# EAGLE design divisor-de-tension (EAGLE 9.6.2)

## Sheet 1 of 2
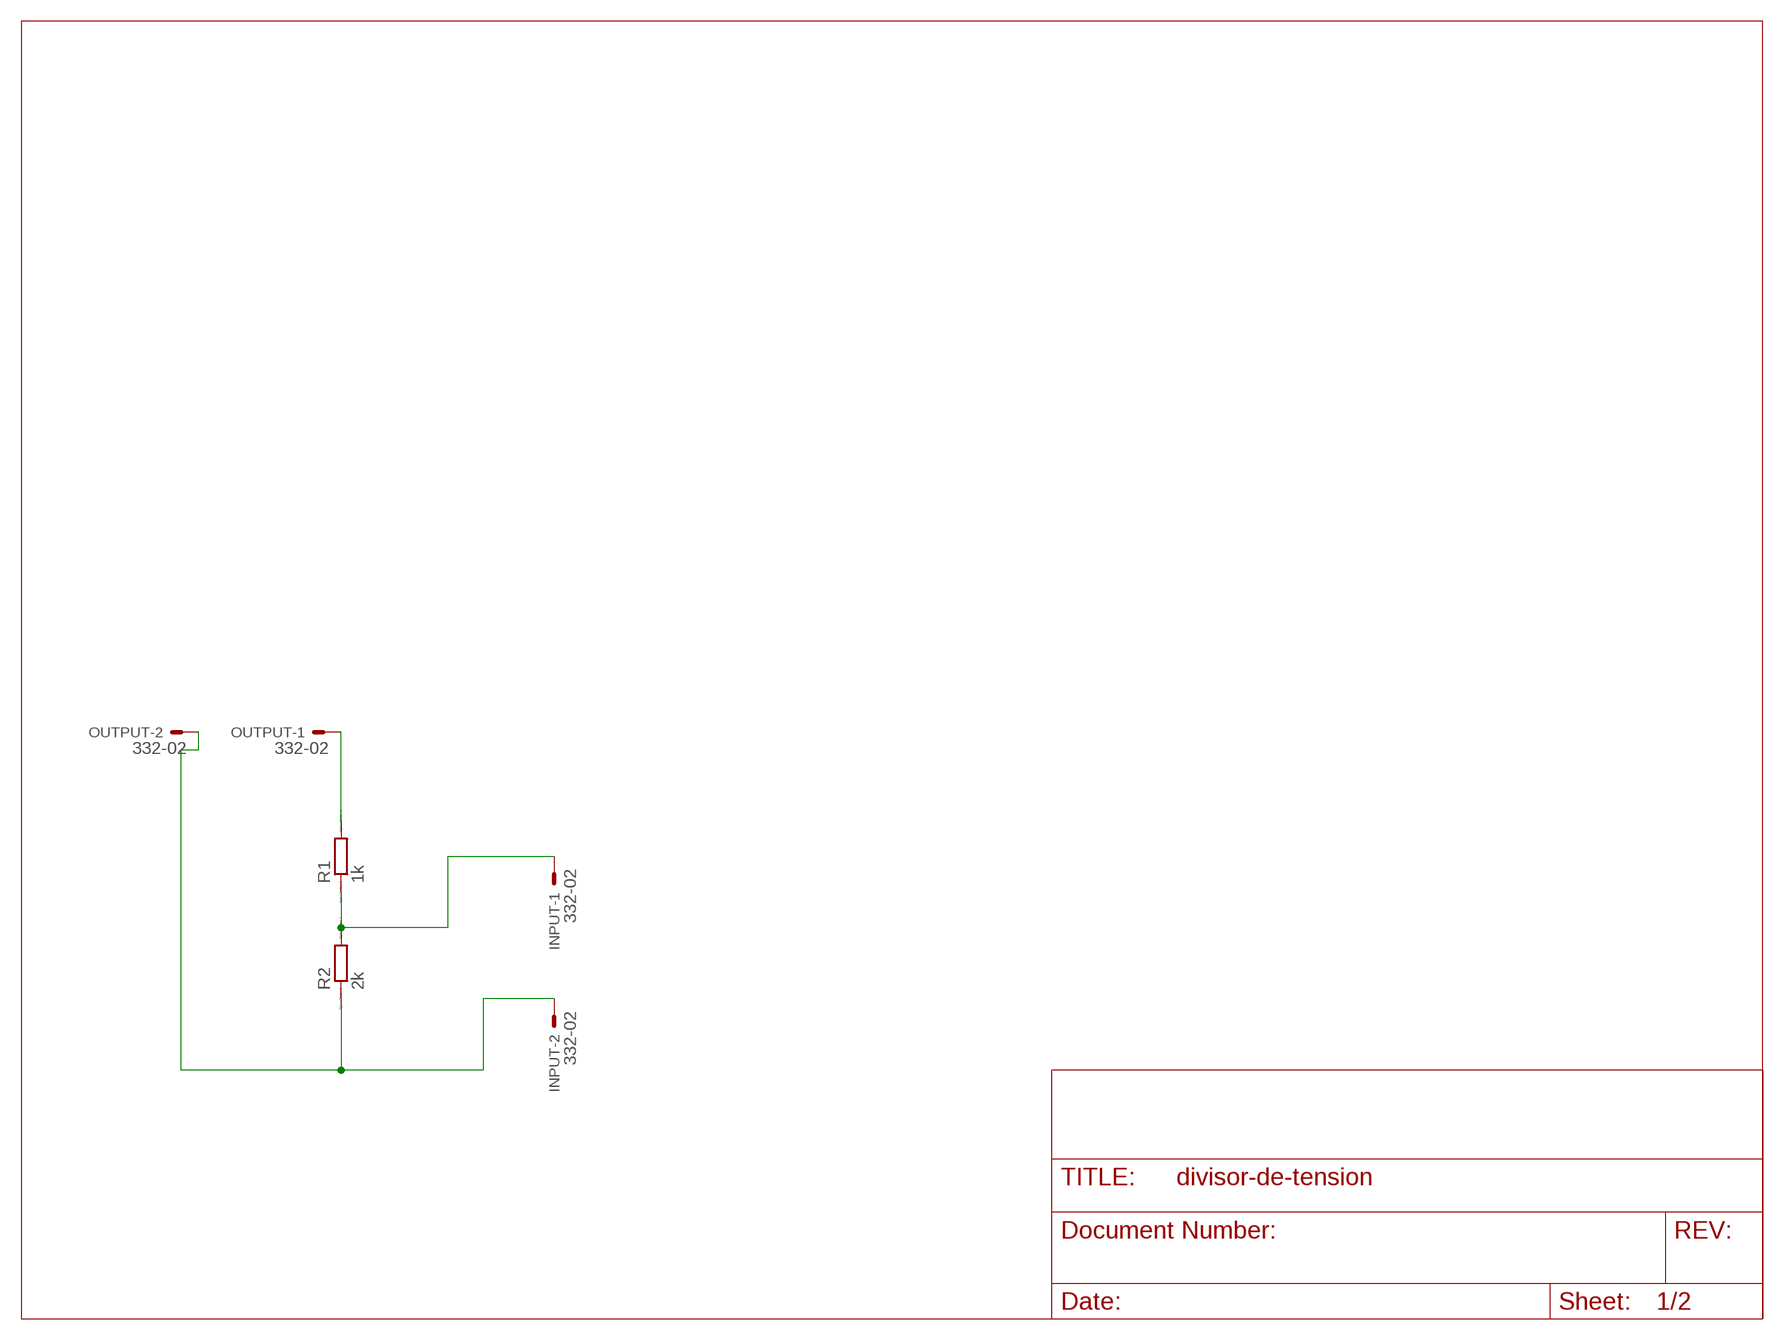
[diagram p0: schematic, sheet 1]

### Parts
INPUT  332-02  [332-02]
OUTPUT  332-02  [332-02]
R1  1k  R0207/10  [0207/10]
R2  2k  R0207/10  [0207/10]

### Nets
N$1: OUTPUT.1 R1.2
N$2: INPUT.2 OUTPUT.2 R2.1
N$4: INPUT.1 R1.1 R2.2

## Sheet 2 of 2

## Library data of the parts
INPUT OUTPUT = con-garry:332-02: 2 Pin - 2mm Dual Row Source: www.mpe-connector.de / garry_shortform_2012.pdf
R1 R2 = eagle-ltspice:R: RESISTOR, European symbol; SPICEMODEL: NONE; SPICEPREFIX: R

## Board
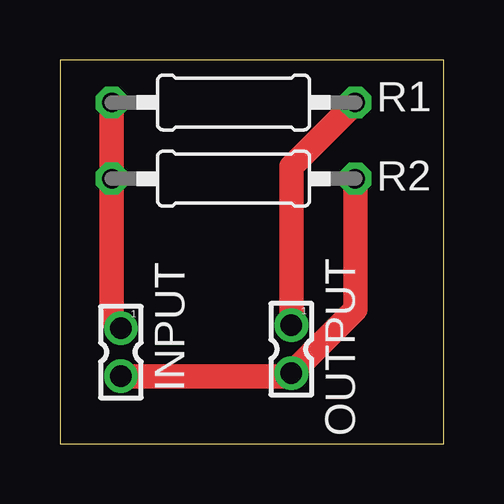
[diagram p1: board, top side]

Size 16 x 16 mm. Coordinates in mm from the lower left corner, seen from the top.
Outline: 0,0 16,0 16,16 0,16 0,0
Copper layers (1*16): Top 0.035mm / dielectric 1.5mm / Bottom 0.035mm
Design rules "default": minimum track width 6mil, minimum drill 0.35mm, track to track 6mil, track to pad 6mil, pad to pad 6mil, via to via 6mil, smd to smd 6mil, copper to edge 40mil, drill to drill 6mil, minimum pad ring 10mil, minimum via ring 8mil, stop-mask expansion 4mil, vias tented up to drill 0mil, thermal gap 10mil

### Footprints (pad centres in the part's own frame; a part is rotated, then mirrored left to right if it is on the bottom)
332-02 = drill 0.9 pad 1.27: 1 0,-1; 2 0,1
0207/10 = drill 0.813 octagon: 1 -5.08,0; 2 5.08,0

### Placement (x,y rotation side)
INPUT  2.54,3.81 180 top
OUTPUT  9.65,3.94 180 top
R1  7.24,14.22 0 top
R2  7.24,11.05 180 top

### Tracks (layer width: path | path; a pad name or v marks a point on that pad's centre or on a via)
N$1
  Top 1.016: OUTPUT.1 9.65,11.56 R1.2
N$2
  Top 1.016: INPUT.2 9.53,2.81 OUTPUT.2 12.32,5.6 R2.1
N$4
  Top 1.016: R1.1 R2.2 2.16,5.19 INPUT.1